# EasyEDA Pro project 主板.eprj, board PCB1
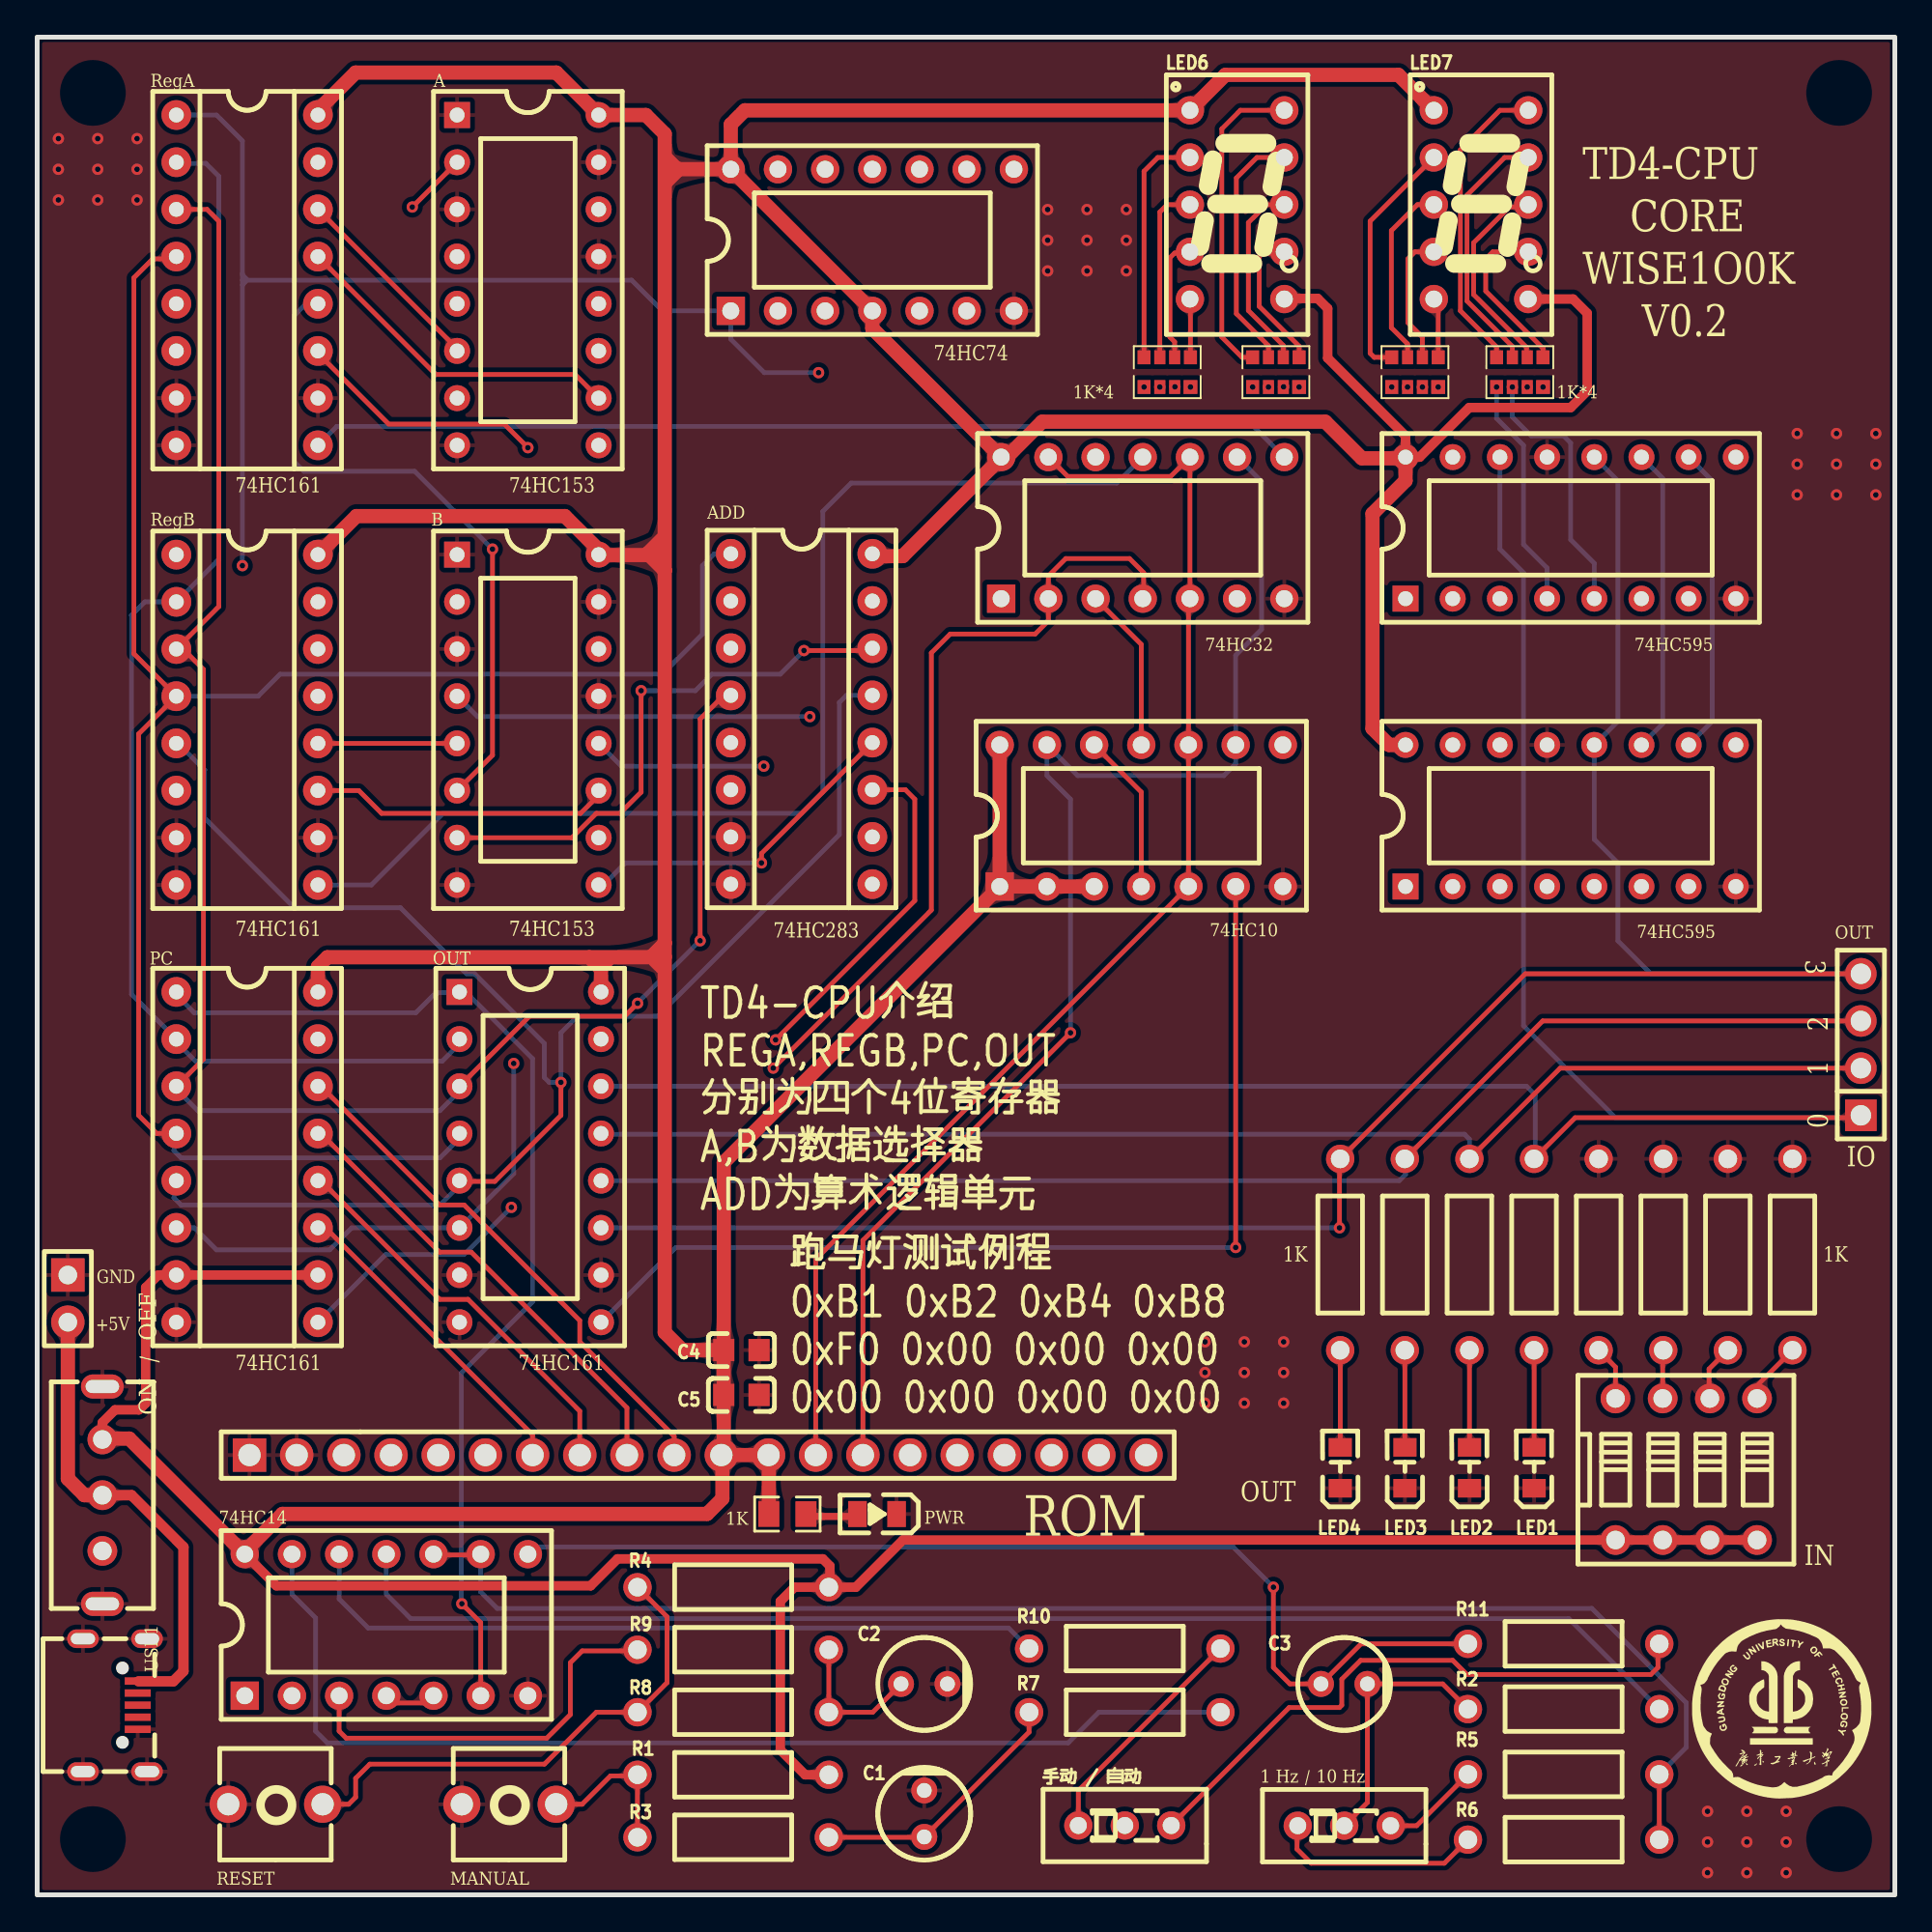
[diagram p2: board, top side]
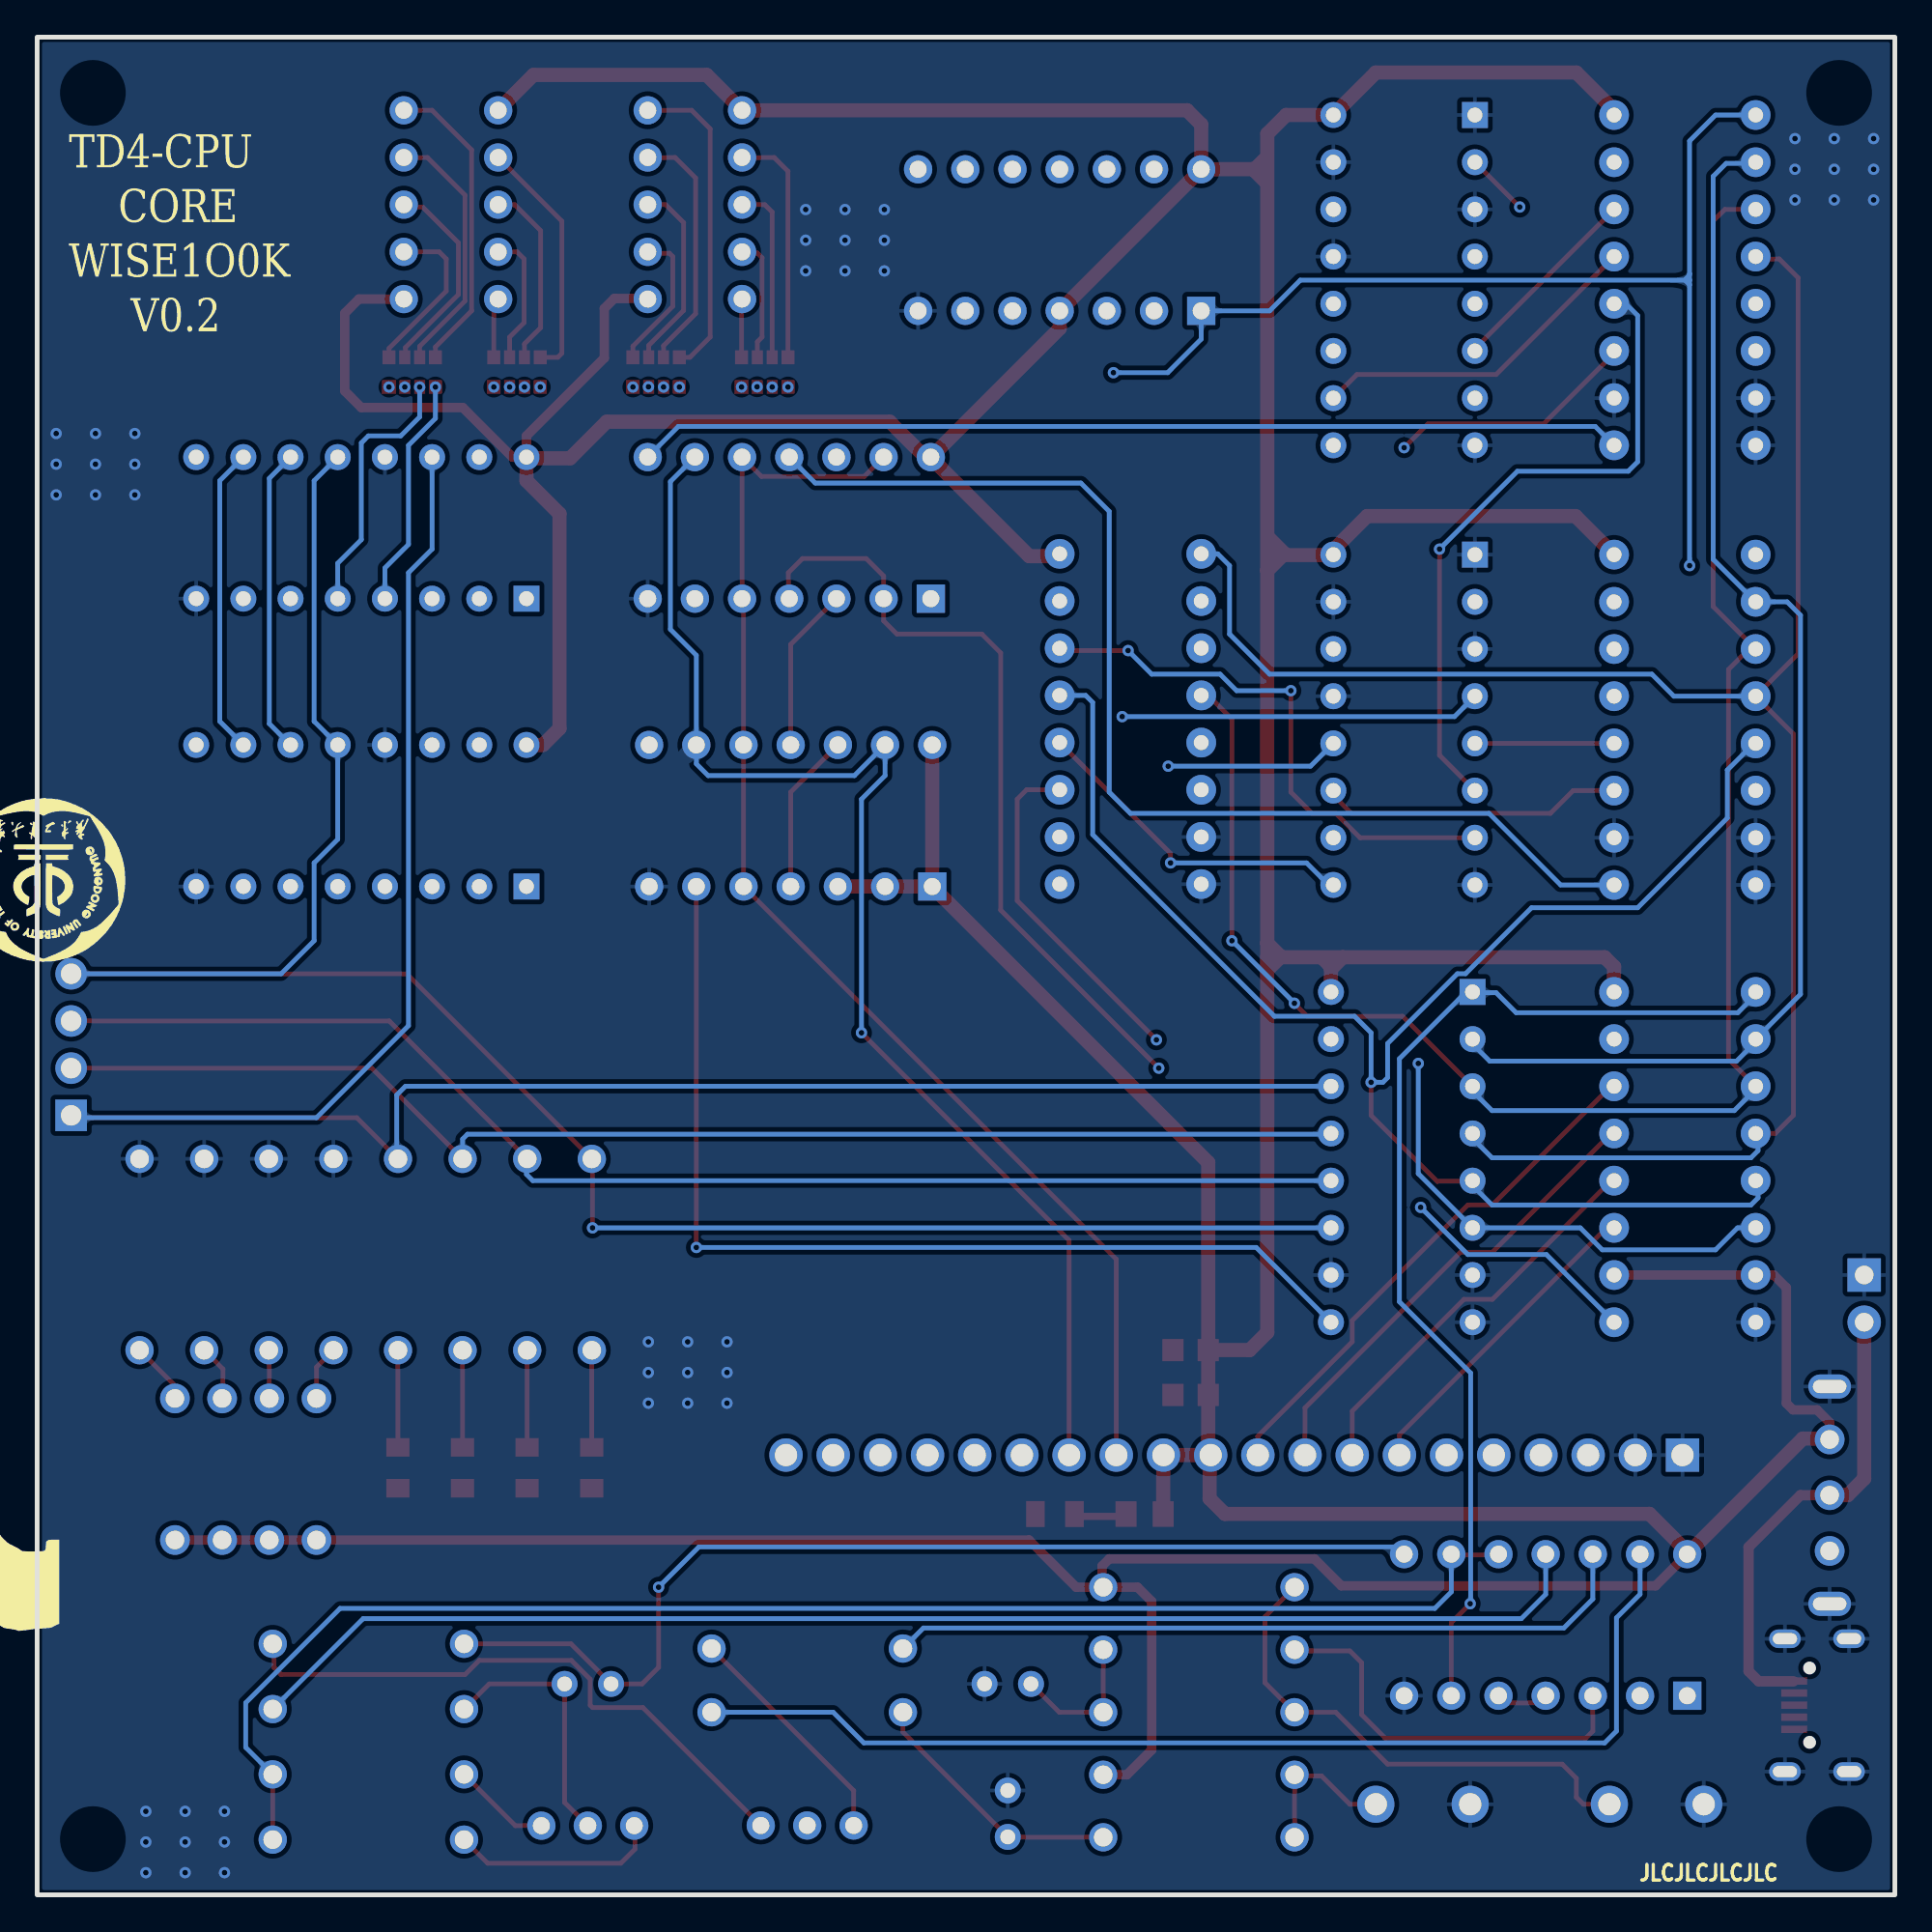
[diagram p3: board, bottom side, seen from below]

Outline 100 x 100 mm; copper layers: Top Layer, Inner1, Inner2, Bottom Layer. Coordinates in mm from the lower left corner of the outline.
Outline path: rectangle 0,100 100,0
Stack: Top Layer 0.035mm 外层铜厚1oz / Dielectric1 0.2104mm 7628 RC49% 8.6mil / Inner1 0.0152mm 内层铜厚 / Dielectric2 1.065mm 1.1mm H/HOZ Copper / Inner2 0.0152mm 内层铜厚 / Dielectric3 0.2104mm 7628 RC49% 8.6mil / Bottom Layer 0.035mm 外层铜厚1oz

## Design rules (mm)
net +5V: VCC
template: 自定义配置
spacing copperThickness1oz (default): track to track 0.102, other pairs 0.152 to 0.3
spacing copperThickness2oz: track to track 0.203, other pairs 0.152 to 0.3
track width copperThickness1oz (default): min 0.127, default 0.254, max 2.54
track width copperThickness2oz: min 0.203, default 0.254, max 2.54
track width VCC: min 0.127, default 0.762, max 2.54
differential pair differentialPair (default): width min 0.127, default 0.254, max 2.54; gap min 0.152, default 0.152
via viaSize (default): diameter min 0.5, default 0.61, max 10; hole min 0.3, default 0.305, max 6.299
net class VCC uses VCC
net +5V uses VCC

## Placement (name value [footprint] x y rotation side)
1 Hz / 10 Hz  SS12D00G3  [SW-TH_SS-12D01-GX]  70.36 3.72 0 top
1K  1K  [R0805]  40.39 20.5 180 top
1K*4  -  [RES-ARRAY-SMD_0603-8P-L3.2-W1.6-TL]  66.68 81.97 90 top
1K*4#2  -  [RES-ARRAY-SMD_0603-8P-L3.2-W1.6-TL]  79.81 81.97 90 top
74HC10  SN74HC10N  [DIP-14_L17.8-W10.1-P2.54-LS7.62-BL]  59.44 58.09 0 top
74HC14  SN74HC14N  [DIP-14_L17.8-W10.1-P2.54-LS7.62-BL]  18.8 14.53 0 top
74HC32  SN74HC32N  [DIP-14_L17.8-W10.1-P2.54-LS7.62-BL]  59.51 73.58 0 top
74HC595  -  [DIP-16_L20.3-W10.1-P2.54-LS7.62-BL]  82.55 58.09 0 top
74HC595#2  -  [DIP-16_L20.3-W10.1-P2.54-LS7.62-BL]  82.55 73.58 0 top
A  SN74HC153N  [DIP-16_L20.3-W10.1-P2.54-LS7.62-BL]  26.42 86.92 270 top
ADD  SN74HC283N  [DIP-16_L20.3-W10.2-P2.54-LS7.6-BL]  41.15 63.3 270 top
B  SN74HC153N  [DIP-16_L20.3-W10.1-P2.54-LS7.62-BL]  26.42 63.25 270 top
C1  电解电容  [CAP-TH_BD5.0-P2.50-D0.5-FD]  47.75 4.37 90 top
C2  电解电容  [CAP-TH_BD5.0-P2.50-D0.5-FD]  47.75 11.35 0 top
C3  电解电容  [CAP-TH_BD5.0-P2.50-D0.5-FD]  70.36 11.35 0 top
C4  电解电容  [C0805]  37.91 29.32 0 top
C5  电解电容  [C0805]  37.91 26.91 0 top
LED1  -  [LED_0805]  80.59 23.04 90 top
LED2  -  [LED_0805]  77.11 23.04 90 top
LED3  -  [LED_0805]  73.63 23.04 90 top
LED4  -  [LED_0805]  70.15 23.04 90 top
LED6  FJ3161AH  [LED-SEG-TH_10P-L14.0-W7.5-P2.54-S5.08-TL]  64.59 90.98 0 top
LED7  FJ3161AH  [LED-SEG-TH_10P-L14.0-W7.5-P2.54-S5.08-TL]  77.72 90.98 0 top
MANUAL  YTS1S0161BBT00  [KEY-TH_2P-L6.0-W6.0-P5.00]  25.4 4.88 0 top
ON  /  OFF  -  [SW-TH_SHOU-HAN_SS12F44G4]  3.51 21.51 90 top
OUT  SN74HC161N  [HDR-TH_4P-P2.54-V-M]  98.17 45.77 90 top
OUT#2  -  [DIP-16_L20.3-W10.1-P2.54-LS7.62-BL]  26.54 39.72 270 top
PC  SN74HC161N  [DIP-16_L20.3-W10.2-P2.54-LS7.6-BL]  11.3 39.72 270 top
PWR  PWR  [LED0805-R-RD_GREEN]  45.21 20.5 180 top
R1  1kΩ  [Res_1/4W]  37.47 6.46 0 top
R2  100Ω  [Res_1/4W]  82.17 10 0 top
R3  10kΩ  [Res_1/4W]  37.47 3.1 0 top
R4  1kΩ  [Res_1/4W]  37.47 16.56 0 top
R5  3.3kΩ  [Res_1/4W]  82.17 6.49 0 top
R6  33kΩ  [Res_1/4W]  82.17 2.97 0 top
R7  100kΩ  [Res_1/4W]  58.55 9.83 0 top
R8  100Ω  [Res_1/4W]  37.47 9.83 0 top
R9  1kΩ  [Res_1/4W]  37.47 13.2 180 top
R10  100Ω  [Res_1/4W]  58.55 13.26 0 top
R11  100Ω  [Res_1/4W]  82.17 13.51 0 top
R12  1kΩ  [Res_1/4W]  70.14 34.47 90 top
R13  1kΩ  [Res_1/4W]  73.62 34.47 90 top
R14  1kΩ  [Res_1/4W]  77.1 34.47 90 top
R15  1kΩ  [Res_1/4W]  80.58 34.47 90 top
R16  1kΩ  [Res_1/4W]  94.49 34.47 90 top
R17  1kΩ  [Res_1/4W]  91.01 34.47 90 top
R18  1kΩ  [Res_1/4W]  87.53 34.47 90 top
R19  1kΩ  [Res_1/4W]  84.05 34.47 90 top
R20  1K排阻0603*4  [RES-ARRAY-SMD_0603-8P-L3.2-W1.6-TL]  60.83 81.97 90 top
R22  1K排阻0603*4  [RES-ARRAY-SMD_0603-8P-L3.2-W1.6-TL]  74.17 81.97 90 top
RegA  SN74HC161N  [DIP-16_L20.3-W10.2-P2.54-LS7.6-BL]  11.3 86.92 270 top
RegB  SN74HC161N  [DIP-16_L20.3-W10.2-P2.54-LS7.6-BL]  11.3 63.25 270 top
RESET  YTS1S0161BBT00  [KEY-TH_2P-L6.0-W6.0-P5.00]  12.83 4.88 0 top
SW1  DS-04RP  [SW-TH_DS-04XP]  88.77 22.91 0 top
U2  SN74HC74N  [DIP-14_L17.8-W10.1-P2.54-LS7.62-BL]  44.96 89.08 0 top
U6  X6511FV-20-C85D32  [HDR-TH_20P-P2.54-V-F]  35.56 23.67 0 top
U7  Jumper2  [HDR-TH_2P-P2.54-V-M-1]  1.65 32.09 270 top
USB1  -  [USB_Micro]  4.19 10.21 270 top
手动 / 自动  SS12D00G3  [SW-TH_SS-12D01-GX]  58.55 3.73 0 top

## Footprints (pads in the part's own frame, mm; a bottom-side part is the same pattern mirrored in y, then rotated)
C0805
  rect 1.14x1.2 smd: 1(-0.95,0) 2(0.95,0)
CAP-TH_BD5.0-P2.50-D0.5-FD
  round 1.4 hole 0.8: 1(-1.25,0) 2(1.25,0)
DIP-14_L17.8-W10.1-P2.54-LS7.62-BL
  rect 1.524x1.524 hole 0.914: 1(-7.62,-3.81)
  round 1.524 hole 0.914: 2(-5.08,-3.81) 3(-2.54,-3.81) 4(0,-3.81) 5(2.54,-3.81) 6(5.08,-3.81) 7(7.62,-3.81) 8(7.62,3.81) 9(5.08,3.81) 10(2.54,3.81) 11(0,3.81) 12(-2.54,3.81) 13(-5.08,3.81) 14(-7.62,3.81)
DIP-16_L20.3-W10.1-P2.54-LS7.62-BL
  rect 1.4x1.4 hole 0.8: 1(-8.89,-3.81)
  round 1.4 hole 0.8: 2(-6.35,-3.81) 3(-3.81,-3.81) 4(-1.27,-3.81) 5(1.27,-3.81) 6(3.81,-3.81) 7(6.35,-3.81) 8(8.89,-3.81) 9(8.89,3.81) 10(6.35,3.81) 11(3.81,3.81) 12(1.27,3.81) 13(-1.27,3.81) 14(-3.81,3.81) 15(-6.35,3.81) 16(-8.89,3.81)
DIP-16_L20.3-W10.2-P2.54-LS7.6-BL
  round 1.6 hole 0.8: 1(-8.89,-3.81) 2(-6.35,-3.81) 3(-3.81,-3.81) 4(-1.27,-3.81) 5(1.27,-3.81) 6(3.81,-3.81) 7(6.35,-3.81) 8(8.89,-3.81) 9(8.89,3.81) 10(6.35,3.81) 11(3.81,3.81) 12(1.27,3.81) 13(-1.27,3.81) 14(-3.81,3.81) 15(-6.35,3.81) 16(-8.89,3.81)
HDR-TH_2P-P2.54-V-M-1
  rect 1.8x1.8 hole 1: 1(-1.27,0)
  round 1.8 hole 1: 2(1.27,0)
HDR-TH_4P-P2.54-V-M
  rect 1.7x1.7 hole 1.1: 1(-3.81,0)
  round 1.7 hole 1.1: 2(-1.27,0) 3(1.27,0) 4(3.81,0)
HDR-TH_20P-P2.54-V-F
  rect 1.8x1.8 hole 1.2: 1(-24.13,0)
  round 1.8 hole 1.2: 2(-21.59,0) 3(-19.05,0) 4(-16.51,0) 5(-13.97,0) 6(-11.43,0) 7(-8.89,0) 8(-6.35,0) 9(-3.81,0) 10(-1.27,0) 11(1.27,0) 12(3.81,0) 13(6.35,0) 14(8.89,0) 15(11.43,0) 16(13.97,0) 17(16.51,0) 18(19.05,0) 19(21.59,0) 20(24.13,0)
KEY-TH_2P-L6.0-W6.0-P5.00
  round 2 hole 1.2: 1(-2.54,0) 2(2.54,0)
LED0805-R-RD_GREEN
  rect 1x1.399 smd: 1(1.05,0) 2(-1.05,0)
LED-SEG-TH_10P-L14.0-W7.5-P2.54-S5.08-TL
  round 1.524 hole 0.914: 1(-2.54,5.08) 2(-2.54,2.54) 3(-2.54,0) 4(-2.54,-2.54) 5(-2.54,-5.08) 6(2.54,-5.08) 7(2.54,-2.54) 8(2.54,0) 9(2.54,2.54) 10(2.54,5.08)
LED_0805
  rect 1x1.25 smd: 1(-1.15,0.005) 2(1.05,0.005)
R0805
  rect 1.133x1.377 smd: 1(-1,0) 2(1,0)
RES-ARRAY-SMD_0603-8P-L3.2-W1.6-TL
  rect 0.75x0.7 smd: 1(-0.8,1.25) 5(0.8,-1.25) 8(0.8,1.25)
  rect 0.75x0.6 smd: 2(-0.8,0.4) 3(-0.8,-0.4) 6(0.8,-0.4) 7(0.8,0.4)
  rect 0.75x0.75 smd: 4(-0.8,-1.25)
Res_1/4W
  round 1.524 hole 1: 1(-5.15,0) 2(5.15,0)
SW-TH_DS-04XP
  round 1.6 hole 1: 1(-3.81,-3.81) 2(-1.27,-3.81) 3(1.27,-3.81) 4(3.81,-3.81) 5(3.81,3.81) 6(1.27,3.81) 7(-1.27,3.81) 8(-3.81,3.81)
SW-TH_SHOU-HAN_SS12F44G4
  round 1.6 hole 1: 1(-3,0) 2(0,0) 3(3,0)
  oval 1.3x2.3 hole 0.7x1.8: 4(5.85,0) 5(-5.85,0)
SW-TH_SS-12D01-GX
  round 1.524 hole 0.914: 1(-2.5,0) 2(0,0) 3(2.5,0)
USB_Micro
  rect 0.4x1.4 smd: 1(-1.3,1.225) 2(-0.65,1.225) 3(0,1.225) 4(0.65,1.225) 5(1.3,1.225)
  oval 1x1.7 hole 0.6x1.3: 6(-3.575,1.725) 6(-3.575,-1.725) 6(3.575,1.725) 6(3.575,-1.725)

## Nets
+5V: 1K.2 74HC10.1 74HC10.2 74HC10.3 74HC10.14 74HC14.14 74HC32.14 74HC595.16 74HC595#2.16 A.16 ADD.16 B.16 C4.1 C5.1 LED6.1 LED6.6 LED7.1 LED7.6 ON  /  OFF.3 OUT#2.16 PC.7 PC.10 PC.16 R1.2 R4.2 RegA.16 RegB.16 SW1.1 SW1.2 SW1.3 SW1.4 U2.4 U2.14 U6.11 U6.12
GND: 74HC10.7 74HC14.7 74HC32.7 74HC595.8 74HC595.13 74HC595#2.8 74HC595#2.13 A.1 A.3 A.8 A.13 A.15 ADD.7 ADD.8 B.1 B.3 B.8 B.13 B.15 C1.2 C2.2 C4.2 C5.2 LED1.1 LED2.1 LED3.1 LED4.1 MANUAL.1 ON  /  OFF.4 ON  /  OFF.5 OUT#2.7 OUT#2.8 OUT#2.10 PC.8 PWR.2 R16.2 R17.2 R18.2 R19.2 RegA.7 RegA.8 RegA.10 RegB.7 RegB.8 RegB.10 RESET.1 U2.7 U6.1 U6.2 U7.1 USB1.5 USB1.6
5A: 74HC14.11 R2.2
5Y: 74HC14.9 74HC14.10 R5.2 R6.2
A0: PC.14 U6.10
A1: PC.13 U6.9
A2: PC.12 U6.8
A3: PC.11 U6.7
AIN0: A.6 RegA.14
AIN1: A.10 RegA.13
AIN2: B.6 RegA.12
AIN3: B.10 RegA.11
BIN0: A.5 RegB.14
BIN1: A.11 RegB.13
BIN2: B.5 RegB.12
BIN3: B.11 RegB.11
D0: ADD.6 U6.20
D1: ADD.2 U6.19
D2: ADD.15 U6.18
D3: ADD.11 U6.17
D4: 74HC32.2 74HC32.4 U6.16
D5: A.2 B.2 U6.15
D6: 74HC10.9 74HC10.13 74HC32.9 U6.14
D7: 74HC10.5 74HC10.10 74HC32.5 74HC32.10 74HC32.13 U6.13
IN0: A.4 R16.1 SW1.5
IN1: A.12 R17.1 SW1.6
IN2: B.4 R18.1 SW1.7
IN3: B.12 R19.1 SW1.8
LEDA1: 1K*4.1 74HC595#2.15
LEDA2: 1K*4#2.1 74HC595#2.4
LEDB1: 1K*4.2 74HC595#2.1
LEDB2: 1K*4#2.2 74HC595#2.5
LEDC1: 1K*4.3 74HC595#2.2
LEDC2: 1K*4#2.3 74HC595#2.6
LEDD1: 74HC595#2.3 R20.4
LEDD2: 74HC595#2.7 R22.4
LEDE1: 74HC595.15 R20.3
LEDE2: 74HC595.4 R22.3
LEDF1: 74HC595.1 R20.1
LEDF2: 74HC595.5 R22.1
LEDG1: 74HC595.2 R20.2
LEDG2: 74HC595.6 R22.2
LEDH1: 1K*4.4 74HC595.3
LEDH2: 1K*4#2.4 74HC595.7
OUT0: 74HC595#2.14 OUT.1 OUT#2.14 R15.2
OUT1: 74HC595.14 OUT.2 OUT#2.13 R14.2
OUT2: 74HC595.11 74HC595#2.11 OUT.3 OUT#2.12 R13.2
OUT3: 74HC595.12 74HC595#2.12 OUT.4 OUT#2.11 R12.2
Y1: A.7 ADD.5
Y2: A.9 ADD.3
Y3: ADD.14 B.7
Y4: ADD.12 B.9
Y12: U6.3
Y13: U6.4
Y14: U6.5
Y15: U6.6
$1N4248: LED4.2 R12.1
$1N4255: LED1.2 R15.1
$1N4259: LED2.2 R14.1
$1N4264: LED3.2 R13.1
$1N6580: ADD.4 OUT#2.3 PC.3 RegA.3 RegB.3
$1N6590: ADD.1 OUT#2.4 PC.4 RegA.4 RegB.4
$1N6595: ADD.13 OUT#2.5 PC.5 RegA.5 RegB.5
$1N6604: ADD.10 OUT#2.6 PC.6 RegA.6 RegB.6
$1N9749: C1.1 R3.2 R7.1
$1N9779: MANUAL.2 R1.1 R3.1
$1N9798: R10.2 手动 / 自动.1
$1N9808: 1 Hz / 10 Hz.2 C3.2 R2.1
$1N9868: R4.1 R8.1 RESET.2
$1N9876: C2.1 R8.2 R9.1
$1N9954: 74HC14.3 R9.2
$1N9958: 74HC14.4 74HC14.5
$1N9962: 74HC14.6 74HC595.10 74HC595#2.10 OUT#2.1 PC.1 RegA.1 RegB.1 U2.1
$1N11263: ADD.9 U2.2
$1N11340: 74HC32.1 U2.6
$1N11344: OUT#2.2 PC.2 RegA.2 RegB.2 U2.3 手动 / 自动.2
$1N12748: R11.2 手动 / 自动.3
$1N12905: 74HC14.13 R7.2
$1N12949: 1 Hz / 10 Hz.3 R5.1
$1N12955: 1 Hz / 10 Hz.1 R6.1
$1N13114: 74HC14.12 R10.1
$1N13155: 74HC14.8 C3.1 R11.1
$1N14608: 74HC10.6 OUT#2.9
$1N14668: 74HC32.6 A.14 B.14
$1N14754: 74HC10.11 74HC32.3
$1N14761: 74HC10.4 74HC10.12 74HC32.12
$1N14785: 74HC10.8 PC.9
$1N14858: 74HC32.8 RegA.9
$1N14897: 74HC32.11 RegB.9
$1N16389: ON  /  OFF.2 U7.2 USB1.1
$1N30627: 1K.1 PWR.1
$1N33937: LED6.2 R20.8
$1N33943: LED6.3 R20.7
$1N33953: LED6.4 R20.6
$1N33959: LED6.5 R20.5
$1N34000: 1K*4.8 LED6.10
$1N34011: 1K*4.7 LED6.9
$1N34029: 1K*4.6 LED6.8
$1N34063: 1K*4.5 LED6.7
$1N35657: LED7.2 R22.8
$1N35663: LED7.3 R22.7
$1N35669: LED7.4 R22.6
$1N35676: LED7.5 R22.5
$1N35683: 1K*4#2.8 LED7.10
$1N35689: 1K*4#2.7 LED7.9
$1N35696: 1K*4#2.6 LED7.8
$1N35703: 1K*4#2.5 LED7.7

Pads without a net: 74HC14 1 2; 74HC595 9; 74HC595#2 9; ON  /  OFF 1; OUT#2 15; PC 15; RegA 15; RegB 15; U2 5 8 9 10 11 12 13; USB1 2 3 4

## Via types
v1: diameter 0.61, hole 0.305, Top Layer to Bottom Layer, 83 vias

## Routing (per net, layer and track width the routed paths; a pad name or vN(x,y) marks a point on that pad's centre or on a via; arc(x,y) is an arc through that point)
+5V: length 500.9
  Top Layer w0.508: LED7.6 82.68,85.9 83.44,85.14 83.44,80.95 82.55,80.06 77.09,80.06 74.42,77.39 74HC595#2.16 73.66,78.54 69.47,82.73 69.47,85.39 68.93,85.93 67.16,85.93 LED6.6 ; R4.2 44.07,16.56 46.61,19.1 SW1.1 SW1.2 SW1.3 SW1.4 ; R4.2 42.67,16.62 42.67,17.7 42.29,18.09 31.24,18.09 29.79,16.64 12.88,16.64 74HC14.14 ; R4.2 40.77,16.56 40,15.8 40,7.8 41.34,6.46 R1.2 ; 15.11,33.36 6.52,33.36 5.84,32.69 5.84,26.47 5.48,26.11 4.19,26.11 3.51,25.43 ON  /  OFF.3
  Top Layer w0.762: 34.51,92.89 33.89,92.89 33.87,92.91 ; 34.51,92.89 34.51,92.93 ; 34.51,92.89 34.51,92.85 33.8,92.14 ; 34.51,92.89 37.33,92.89 U2.14 ; 33.78,71.3 33.76,71.3 32.94,72.12 ; 33.78,71.3 33.8,71.3 ; 33.78,71.3 33.78,51.23 ; 33.78,71.3 33.78,94.79 32.77,95.81 A.16 27.94,98.09 17.14,98.09 15.11,96.06 RegA.16 ; U2.14 37.34,95.3 38.1,96.06 LED6.1 63.96,97.97 73.28,97.97 LED7.1 ; U2.14 44.82,85.41 44.96,85.41 44.96,84.32 51.9,77.38 ; OUT#2.16 30.35,49.83 29.72,50.47 ; 74HC32.14 52.2,77.39 54.1,79.3 69.34,79.3 71.31,77.33 73.6,77.33 74HC595#2.16 73.66,76.12 71.88,74.35 71.88,62.79 72.77,61.9 74HC595.16 ; 33.78,50.5 33.75,50.47 33.09,50.47 ; 33.78,50.5 33.78,51.23 ; 33.78,50.5 33.78,30.28 34.73,29.32 C4.1 ; C4.1 C5.1 36.96,23.8 U6.11 ; C4.1 36.96,39.42 74HC10.1 ; ON  /  OFF.3 3.56,24.56 4.95,24.56 74HC14.14 11.18,18.47 13.21,20.51 36.06,20.51 36.89,21.33 36.89,23.62 U6.11 ; 32.94,72.12 33.66,72.12 33.75,72.21 ; 32.94,72.12 32.88,72.18 32.88,72.22 33.7,73.04 ; 32.94,72.12 30.46,72.12 ; 33.78,51.23 33.11,50.56 33.11,50.55 ; 33.78,51.23 33.79,51.24 ; 74HC10.1 74HC10.2 74HC10.3 ; 74HC10.1 74HC10.14 ; 29.72,50.47 33.09,50.47 ; 29.72,50.47 15.62,50.47 15.11,49.96 PC.16 ; 33.09,50.47 33.07,50.48 ; 33.09,50.47 33.75,49.81 ; 30.8,50.42 30.4,50.01 30.4,49.97 ; U6.11 U6.12 39.39,23.66 1K.2 ; RegB.16 17.19,74.22 28.4,74.22 30.48,72.14 ; 51.82,77.29 46.59,72.06 44.97,72.06 ; 34.4,92.94 33.85,93.5
GND:
  vias: v1(1.14,94.54) v1(1.14,92.89) v1(1.14,91.24) v1(3.26,94.54) v1(3.26,92.89) v1(3.26,91.24) v1(5.38,94.54) v1(5.38,92.89) v1(5.38,91.24) v1(54.4,90.72) v1(54.4,89.07) v1(54.4,87.42) v1(56.51,90.72) v1(56.51,89.07) v1(56.51,87.42) v1(58.63,90.72) v1(58.63,89.07) v1(58.63,87.42) v1(62.87,29.77) v1(62.87,28.12) v1(62.87,26.47) v1(64.98,29.77) v1(64.98,28.12) v1(64.98,26.47) v1(67.1,29.77) v1(67.1,28.12) v1(67.1,26.47) v1(89.92,4.5) v1(89.92,2.84) v1(89.92,1.19) v1(92.03,4.5) v1(92.03,2.84) v1(92.03,1.19) v1(94.15,4.5) v1(94.15,2.84) v1(94.15,1.19) v1(94.74,78.66) v1(94.74,77.01) v1(94.74,75.36) v1(96.86,78.66) v1(96.86,77.01) v1(96.86,75.36) v1(98.98,78.66) v1(98.98,77.01) v1(98.98,75.36)
5A: length 73.6
  Bottom Layer w0.254: 18.8,18.73 18.8,16.18 20.11,14.87 82.45,14.87 R2.2
5Y: length 80.7
  Top Layer w0.254: 21.34,18.73 21.77,18.3 23.44,18.3 23.88,18.73 ; R6.2 R5.2
  Bottom Layer w0.254: 23.88,18.73 23.88,16.31 24.77,15.42 83.69,15.42 88.77,10.34 88.77,7.94 R5.2
A0: length 28.5
  Top Layer w0.254: U6.10 34.29,24.69 29.21,29.77 29.21,30.91 22.99,37.14 21.66,37.14 15.27,43.53
A1: length 25.1
  Top Layer w0.254: 15.27,40.98 21.66,34.59 23.37,34.59 31.75,26.21 U6.9
A2: length 21.4
  Top Layer w0.254: U6.8 29.21,26.04 23.19,32.06 21.66,32.06 15.27,38.44
A3: length 16.8
  Top Layer w0.254: 15.53,35.91 26.67,24.76 U6.7
AIN0: length 10.7
  Top Layer w0.254: RegA.14 22.61,83.24 A.6
AIN1: length 18.3
  Top Layer w0.254: RegA.13 21.46,81.84 28.96,81.84 A.10
AIN2: length 35.8
  Top Layer w0.254: B.6 24.51,61.35 v1(24.51,72.44)
  Bottom Layer w0.254: v1(24.51,72.44) 20.32,76.63 14.35,76.63 13.84,77.14 13.84,85.01 14.48,85.65 RegA.12
AIN3: length 36.1
  Top Layer w0.254: v1(26.42,77.9) 25.15,79.17 18.92,79.17 15.11,82.98 RegA.11
  Inner1 w0.254: v1(26.42,77.9) 26.42,60.71 B.10
BIN0: length 22.4
  Inner1 w0.254: RegB.14 20.29,72.24 20.29,84.47 21.46,85.65 A.5
BIN1: length 24.8
  Inner1 w0.254: A.11 21.34,74.22 21.34,70.75 RegB.13
BIN2: length 7.5
  Top Layer w0.254: RegB.12 B.5
BIN3: length 16.3
  Top Layer w0.254: B.11 30.23,59.19 29.25,58.22 18.54,58.22 17.32,59.44 RegB.11
D0: length 46.2
  Inner1 w0.254: ADD.6 39.24,59.49 40,58.72 40,54.41 59.69,34.72 U6.20
D1: length 56.3
  Inner1 w0.254: U6.19 57.15,32.56 34.8,54.92 34.8,67.11 37.34,69.65
D2: length 66.4
  Inner1 w0.254: 44.96,69.65 43.81,70.79 35.81,70.79 33.53,68.5 33.53,54.53 54.61,33.45 U6.18
D3: length 46
  Top Layer w0.254: ADD.11 46.74,59.49 47.24,58.98 47.24,53.52 v1(39.75,46.03)
  Inner1 w0.254: U6.17 52.07,33.71 v1(39.75,46.03)
D4: length 67.5
  Top Layer w0.254: 74HC32.4 59.56,69.82 59.56,71.17 58.8,71.93 55.37,71.93 54.43,71 74HC32.2 54.43,68.58 53.72,67.87 49.15,67.87 48.13,66.85 48.13,53.01 v1(39.62,44.5)
  Inner1 w0.254: v1(39.62,44.5) 49.53,34.59 U6.16
D5: length 81.8
  Top Layer w0.254: A.2 v1(20.19,90.86)
  Inner1 w0.254: U6.15 46.99,35.1 24.26,57.84 24.26,68.21 22.86,69.6 B.2
  Inner2 w0.254: B.2 20.19,72.02 v1(20.19,90.86)
D6: length 72.1
  Top Layer w0.254: v1(55.63,46.41) 44.45,35.23 U6.14
  Bottom Layer w0.254: v1(55.63,46.41) 55.63,58.98 54.36,60.25 74HC10.13 56.01,60.25 63.88,60.25 64.52,60.88 74HC10.9 64.52,66.73 65.91,68.12 65.91,76.08 74HC32.9
D7: length 70.5
  Top Layer w0.254: 74HC32.13 55.48,76.35 61.01,76.35 74HC32.10 74HC32.5 61.98,69.7 74HC10.10 74HC10.5 41.91,34.21 U6.13
IN0: length 120.4
  Top Layer w0.254: 92.58,27.41 R16.1
  Inner1 w0.254: A.4 23.76,88.19 25.03,86.92 31.24,86.92 33.93,84.23 42.06,84.23 47.24,79.05 47.24,54.15 50.04,51.36 84.07,51.36 92.71,42.72 92.71,31.1 R16.1
IN1: length 106.8
  Top Layer w0.254: SW1.6 90,26.76 90,28.31 R17.1
  Inner1 w0.254: R17.1 89.15,31.17 89.15,44.88 83.69,50.34 49.4,50.34 46.61,53.14 46.61,72.82 36.07,83.36 32.38,83.36 30.23,85.52 A.12
IN2: length 95.7
  Top Layer w0.254: R18.1 87.5,29.29 SW1.7 87.5,26.47
  Inner1 w0.254: R18.1 85.98,30.87 85.98,46.41 83.19,49.2 48.51,49.2 41.59,56.12 v1(41.59,63.42)
  Bottom Layer w0.254: v1(41.59,63.42) 23.71,63.42 B.4
IN3: length 82.7
  Top Layer w0.254: 84.96,26.47 SW1.8 84.96,28.41 R19.1
  Inner1 w0.254: R19.1 82.3,31.08 82.3,47.68 81.79,48.18 47.62,48.18 40.89,54.92 40.89,58.98 v1(39.12,60.76)
  Bottom Layer w0.254: v1(39.12,60.76) 31.45,60.76 B.12
LEDA1: length 14.7
  Inner1 w0.254: 74HC595#2.15 76.2,76.38 75.82,76 72.26,76 68.25,80.01 65.61,80.01 65.43,80.19 v1(65.43,81.17)
LEDA2: length 12.5
  Bottom Layer w0.254: 74HC595#2.4 81.28,71.42 80.01,72.69 80.01,78.03 78.56,79.48 v1(78.56,81.17)
LEDB1: length 14.4
  Inner2 w0.254: v1(66.28,81.17) 66.28,79.72 73.66,72.34 74HC595#2.1
LEDB2: length 14.2
  Bottom Layer w0.254: v1(79.41,81.17) 79.41,79.55 80.43,78.54 82.17,78.54 82.55,78.16 82.55,72.95 83.82,71.68 74HC595#2.5
LEDC1: length 15.2
  Inner2 w0.254: v1(67.09,81.18) 67.09,79.81 76.2,70.7 74HC595#2.2
LEDC2: length 15.8
  Inner2 w0.254: v1(80.21,81.17) 80.21,79.68 81.35,78.54 84.58,78.54 85.09,78.03 85.09,73.2 86.36,71.93 74HC595#2.6
LEDD1: length 21.9
  Inner1 w0.254: 74HC595#2.3 77.59,69.77 67.88,79.48 62.81,79.48 62.08,80.21 v1(62.08,81.17)
LEDD2: length 20.2
  Inner1 w0.254: 74HC595#2.7 82.42,76.25 82.42,78.66 81.46,79.63 75.92,79.63 75.42,80.13 v1(75.42,81.17)
LEDE1: length 27.4
  Inner1 w0.254: v1(61.25,81.18) 61.25,79.98 62.1,79.12 65.38,79.12 65.64,78.87 65.64,77.29 71.69,71.23 71.69,66.41 74HC595.15
LEDE2: length 32.1
  Inner1 w0.254: 74HC595.4 81.28,55.93 79.88,57.33 79.88,78.54 79.3,79.12 75.13,79.12 74.57,79.68 v1(74.57,81.17)
LEDF1: length 32.7
  Inner1 w0.254: v1(59.58,81.17) 59.58,79.88 60.56,78.91 60.56,76.15 65.79,70.92 65.79,65.33 73.66,57.45 74HC595.1
LEDF2: length 33
  Inner2 w0.254: 74HC595.5 83.82,55.68 79.88,59.61 79.88,71.93 78.74,73.08 75.95,73.08 74.93,74.09 74.93,77.51 72.92,79.52 v1(72.92,81.17)
LEDG1: length 34.1
  Inner1 w0.254: v1(60.43,81.17) 60.43,79.91 61.67,78.66 62.84,78.66 63.1,78.41 63.1,76.4 68.45,71.04 68.45,65.46 76.2,57.71 74HC595.2
LEDG2: length 35.7
  Inner2 w0.254: v1(73.77,81.17) 73.79,81.15 73.79,79.68 74.8,78.66 77.09,78.66 77.47,78.28 77.47,74.22 77.98,73.71 81.79,73.71 82.42,73.08 82.42,60 86.36,56.06 74HC595.6
LEDH1: length 31.4
  Inner2 w0.254: v1(67.93,81.17) 67.94,81.15 67.94,79.93 77.6,70.28 77.6,56.31 78.74,55.17 74HC595.3
LEDH2: length 32.8
  Inner2 w0.254: v1(81.06,81.17) 81.06,79.77 81.79,79.05 86.36,79.05 87.63,77.78 87.63,57.45 88.9,56.19 74HC595.7
OUT0: length 123.6
  Top Layer w0.254: OUT.1 98.04,41.83 82.79,41.83 R15.2
  Bottom Layer w0.254: 74HC595#2.14 78.74,72.44 80.01,71.17 80.01,46.79 84.96,41.83 98.04,41.83 OUT.1 ; 30.64,43.53 80.18,43.53 80.65,43.06 80.65,39.69 R15.2
OUT1: length 101.7
  Top Layer w0.254: OUT.2 81.98,44.5 R14.2
  Inner1 w0.254: OUT.2 92.07,44.5 84.33,52.25 81.15,52.25 80.01,53.39 80.01,55.3 78.74,56.57 74HC595.14
  Bottom Layer w0.254: R14.2 77.1,40.68 76.84,40.94 30.55,40.94 30.51,40.98
OUT2: length 112.2
  Top Layer w0.254: OUT.3 81.04,47.04 R13.2
  Inner1 w0.254: 74HC595.11 86.36,57.33 87.63,56.06 87.63,50.34 90.93,47.04 OUT.3
  Bottom Layer w0.254: 74HC595.11 87.5,63.04 87.5,76.25 74HC595#2.11 ; R13.2 73.62,39.08 73.66,39.04 73.66,38.79 73.32,38.44 30.51,38.44
OUT3: length 116.9
  Top Layer w0.254: OUT.4 80.11,49.58 R12.2 70.1,39.58 v1(70.1,35.91)
  Bottom Layer w0.254: 30.51,35.91 v1(70.1,35.91) ; OUT.4 86.87,49.58 85.09,51.36 85.09,55.55 83.82,56.82 74HC595.12 85.09,63.17 85.09,76.12 74HC595#2.12
Y1: length 29
  Inner2 w0.254: ADD.5 33.4,65.96 26.03,65.96 25.34,66.66 25.34,77.84 A.7
Y2: length 13.9
  Inner2 w0.254: A.9 30.23,74.22 ADD.3
Y3: length 29.8
  Top Layer w0.254: v1(32.51,64.82) 32.51,59.36 31.37,58.22 30.1,58.22 28.79,56.9 B.7 ; v1(41.28,66.98) 44.83,66.98 ADD.14
  Bottom Layer w0.254: v1(32.51,64.82) 35.43,64.82 36.32,65.71 40,65.71 v1(41.28,66.98)
Y4: length 18.2
  Top Layer w0.254: v1(38.99,55.55) 38.99,56.06 ADD.12
  Bottom Layer w0.254: v1(38.99,55.55) 31.67,55.55 30.48,54.36 B.9
$1N4248: length 5.4
  Top Layer w0.254: 70.15,29.31 70.15,29.44 ; 70.15,29.31 LED4.2 ; 70.15,29.31 R12.1
$1N4255: length 5.4
  Top Layer w0.254: 80.58,29.31 R15.1 ; 80.58,29.31 80.58,29.44 ; 80.58,29.31 LED1.2
$1N4259: length 5.4
  Top Layer w0.254: LED2.2 77.1,29.31 ; 77.1,29.31 R14.1 ; 77.1,29.31 77.1,29.44
$1N4264: length 5.4
  Top Layer w0.254: 73.63,29.31 R13.1 ; 73.63,29.31 LED3.2 ; 73.63,29.31 73.63,29.44
$1N6580: length 97.9
  Top Layer w0.254: v1(35.69,51.36) 35.69,63.3 36.96,64.57 ADD.4 ; OUT#2.3 26.5,47.3 31.62,47.3 v1(32.32,47.99) ; PC.3 8.95,44.98 8.95,65.96 7.85,67.06 RegB.3 9.78,69.35 9.78,90.09 9.14,90.73 RegA.3
  Bottom Layer w0.254: 22.57,43.1 21.68,42.22 8.64,42.22 7.33,43.53 ; 35.68,51.36 32.32,48.01 v1(32.32,47.99)
$1N6590: length 103.9
  Top Layer w0.254: PC.4 6.44,40.98 5.46,41.96 5.46,62.49 RegB.4 5.21,66.81 5.21,87.05 6.22,88.06 7.37,88.06 RegA.4
  Bottom Layer w0.254: RegB.4 11.89,64.52 13.08,65.71 33.66,65.71 35.81,67.87 35.81,71.55 36.45,72.19 ADD.1 ; 22.57,40.56 21.68,39.67 7.75,39.67 7.37,40.06 7.37,40.95 7.33,40.98
$1N6595: length 114
  Top Layer w0.254: 22.73,38.44 22.77,38.41 24.64,38.41 28.19,41.96 v1(28.19,43.74)
  Inner2 w0.254: RegB.5 9.78,64.27 9.78,85.14 9.27,85.65 RegA.5
  Bottom Layer w0.254: RegB.5 7.54,62.03 9.01,60.55 9.02,60.55 9.02,57.96 13.84,53.14 19.56,53.14 23.11,49.58 23.55,49.58 27.31,45.83 27.31,43.99 27.56,43.74 v1(28.19,43.74) 28.19,46.41 29.08,47.3 33.4,47.3 43.18,57.07 43.18,64.19 43.56,64.57 ADD.13 ; 22.57,38.02 21.68,37.14 7.75,37.14 7.37,37.52 7.37,38.41 7.33,38.44
$1N6604: length 101.8
  Inner2 w0.254: ADD.10 32.77,44.75 v1(25.65,44.75) 23.11,47.3 19.69,47.3 7.54,59.44 RegB.6 5.63,59.44 5.08,60 5.08,80.7 RegA.6
  Bottom Layer w0.254: OUT#2.6 25.65,38.83 v1(25.65,44.75) ; 22.57,35.48 22.15,35.91 16.93,35.91 15.75,34.72 9.65,34.72 8.47,35.91 7.33,35.91
$1N9749: length 14.2
  Top Layer w0.254: R3.2 47.73,3.1 C1.1 53.4,8.76 R7.1
$1N9779: length 8.4
  Top Layer w0.254: MANUAL.2 29.34,4.88 30.86,6.4 32.25,6.4 R1.1 R3.1
$1N9798: length 12.7
  Top Layer w0.254: R10.2 56.05,5.61 手动 / 自动.1
$1N9808: length 14.1
  Top Layer w0.254: 1 Hz / 10 Hz.2 71.61,4.97 C3.2 75.66,11.35 R2.1
$1N9868: length 27.6
  Top Layer w0.254: RESET.2 16.76,4.88 17.14,5.26 17.14,6.27 17.91,7.04 27.31,7.04 30.1,9.83 R8.1 33.91,11.42 33.91,14.97 R4.1
$1N9876: length 7.9
  Top Layer w0.254: C2.1 44.98,9.83 R8.2 R9.1
$1N9954: length 21.3
  Top Layer w0.254: 16.26,10.33 16.26,8.81 16.64,8.43 27.43,8.43 28.7,9.7 28.7,12.5 29.34,13.13 32.25,13.13 R9.2
$1N9958: length 2.5
  Top Layer w0.254: 18.8,10.33 21.34,10.33
$1N9962: length 219.3
  Top Layer w0.254: 23.88,10.33 23.88,14.66 v1(22.86,15.67)
  Inner1 w0.254: RegB.1 10.46,72.14 v1(11.05,71.55)
  Inner2 w0.254: v1(11.05,71.55) 12.65,69.95 12.65,57.84 14.81,55.68 15.66,55.68 OUT#2.1 ; v1(42.06,81.94) 87.4,81.94 88.9,80.44 74HC595#2.10
  Bottom Layer w0.254: v1(11.05,71.55) 11.05,86.92 ; 11.05,86.92 32,86.92 33.66,85.27 U2.1 37.34,83.74 39.14,81.94 v1(42.06,81.94) ; 11.05,86.92 11.05,87.26 ; 11.05,87.26 11.05,94.41 9.65,95.81 RegA.1 ; 11.05,87.26 11.06,87.19 11.28,86.97 ; 11.05,86.67 11.06,86.67 11.29,86.91 ; 74HC595.10 90.17,63.17 90.17,76.12 74HC595#2.10 ; v1(22.86,15.67) 22.83,15.7 22.83,28.09 26.67,31.93 26.67,45.01 23.07,48.61 OUT#2.1 22.69,48.56 21.46,48.56 20.38,47.49 8.45,47.49 7.33,48.61
$1N11263: length 37.1
  Inner2 w0.254: ADD.9 46.48,55.93 46.48,57.84 46.1,58.22 41.15,58.22 39.88,59.49 U2.2
$1N11340: length 17.4
  Inner1 w0.254: 74HC32.1 53.21,71.09 53.21,82.09 U2.6
$1N11344: length 179.6
  Inner2 w0.254: U2.3 42.42,86.54 41.78,87.17 37.08,87.17 32.26,92 13.08,92 11.81,93.27 RegA.2 ; OUT#2.2 24.26,44.54 24.26,35.86 25.57,34.55 50.21,34.55 55.88,28.88 55.88,6.4 手动 / 自动.2
  Bottom Layer w0.254: 7.33,46.06 8.52,44.88 21.81,44.88 22.57,45.64 ; RegA.2 7.56,93.21 9.08,93.21 9.78,92.51 9.78,71.89 RegB.2 5.8,69.6 5.08,68.89 5.08,48.48 PC.2
$1N12748: length 32.5
  Top Layer w0.254: R11.2 87.25,13.44 87.25,12.24 86.87,11.86 76.96,11.86 76.2,12.62 71.25,12.62 70.23,11.61 70.23,10.21 70.1,10.08 67.4,10.08 手动 / 自动.3
$1N12905: length 60.1
  Bottom Layer w0.254: 13.72,18.73 13.72,16.18 14.99,14.91 14.99,8.81 15.62,8.18 55.5,8.18 57.15,9.83 R7.2
$1N12949: length 5.3
  Top Layer w0.254: R5.1 74.26,3.72 1 Hz / 10 Hz.3
$1N12955: length 11.3
  Top Layer w0.254: 1 Hz / 10 Hz.1 67.82,3.68 67.82,2.46 68.58,1.7 75.75,1.7 R6.1
$1N13114: length 41
  Bottom Layer w0.254: R10.1 52.29,14.36 17.82,14.36 16.26,15.93 16.26,18.73
$1N13155: length 57.1
  Top Layer w0.254: v1(66.55,16.56) 66.55,12.24 67.44,11.35 C3.1 71.27,13.51 R11.1
  Bottom Layer w0.254: 26.42,18.73 64.38,18.73 v1(66.55,16.56)
$1N14608: length 55.3
  Top Layer w0.254: v1(64.52,34.85) 74HC10.6
  Bottom Layer w0.254: OUT#2.9 34.38,34.85 v1(64.52,34.85)
$1N14668: length 73.9
  Inner2 w0.254: B.14 30.23,67.32 28.19,69.35 28.19,88.7 A.14 34.42,86.54 40.64,86.54 41.15,86.03 41.15,76.63 41.78,76 58.37,76 74HC32.6
$1N14754: length 8.9
  Top Layer w0.254: 74HC10.11 59.44,67.31 74HC32.3
$1N14761: length 25.4
  Top Layer w0.254: 74HC10.12 59.44,59.36 74HC10.4
  Inner1 w0.254: 74HC10.12 56.9,64.44 55.5,65.84 55.5,74.09 57.02,75.62 57.02,77.34 74HC32.12
$1N14785: length 66.4
  Inner2 w0.254: 74HC10.8 67.06,61.77 60.71,55.42 60.71,52.88 44.83,37.01 v1(25.53,37.01)
  Bottom Layer w0.254: PC.9 18.76,34.47 22.99,34.47 v1(25.53,37.01)
$1N14858: length 53.1
  Bottom Layer w0.254: 74HC32.8 65.48,79.05 16.13,79.05 RegA.9
$1N14897: length 62.8
  Bottom Layer w0.254: 74HC32.11 58.12,76 43.81,76 42.29,74.47 42.29,59.36 41.15,58.22 21.84,58.22 17.99,54.36 RegB.9
$1N16389: length 25.5
  Top Layer w0.559: ON  /  OFF.2 5.08,21.51 7.87,18.72 7.87,12.04 7.33,11.49 5.46,11.49
  Top Layer w0.762: U7.2 1.65,22.4 2.54,21.51 ON  /  OFF.2
$1N30627: length 2.6
  Top Layer w0.381: 41.51,20.37 44.16,20.37
$1N33937: length 12.8
  Top Layer w0.254: R20.8 59.58,92.78 60.32,93.52 LED6.2
$1N33943: length 9.6
  Top Layer w0.254: R20.7 60.43,90.58 60.83,90.98 LED6.3
$1N33953: length 6.7
  Top Layer w0.254: LED6.4 61.99,88.38 61.23,88.38 60.98,88.13 60.98,83.85 61.23,83.6 R20.6
$1N33959: length 3.1
  Top Layer w0.254: LED6.5 62.08,85.87 R20.5
$1N34000: length 17.1
  Top Layer w0.254: 1K*4.8 64.86,82.77 63.77,83.86 63.77,95.06 64.77,96.06 LED6.10
$1N34011: length 13.4
  Top Layer w0.254: 1K*4.7 66.28,83.39 64.55,85.12 64.55,92.42 65.66,93.52 LED6.9
$1N34029: length 10.4
  Top Layer w0.254: 67.08,82.77 67.08,83.4 65.2,85.28 65.2,90.02 66.17,90.98 LED6.8
$1N34063: length 7.8
  Top Layer w0.254: LED6.7 67.06,88.37 65.97,88.37 65.79,88.19 65.79,85.51 67.93,83.36 1K*4.5
$1N35657: length 13.2
  Top Layer w0.254: R22.8 71.97,82.77 71.75,82.98 71.75,90.09 LED7.2
$1N35663: length 10
  Top Layer w0.254: LED7.3 74.29,90.98 72.9,89.59 72.9,84.36 73.77,83.49 R22.7
$1N35669: length 7.2
  Top Layer w0.254: R22.6 74.57,83.85 73.79,84.63 73.79,88.06 74.17,88.44 LED7.4
$1N35676: length 3.2
  Top Layer w0.254: R22.5 75.42,85.67 LED7.5
$1N35683: length 16.5
  Top Layer w0.254: 1K*4#2.8 78.56,83.32 76.61,85.27 76.61,93.94 78.74,96.06 LED7.10
$1N35689: length 13.9
  Top Layer w0.254: 1K*4#2.7 79.41,83.35 76.97,85.8 76.97,91.5 78.99,93.52 LED7.9
$1N35696: length 11.2
  Top Layer w0.254: 1K*4#2.6 80.17,82.8 80.17,83.3 77.32,86.15 77.32,88.93 79.25,90.86 80.14,90.86 LED7.8
$1N35703: length 9
  Top Layer w0.254: LED7.7 78.36,88.44 77.98,88.06 77.98,86.33 81.06,83.25 1K*4#2.5

## Copper pours and planes (outline as drawn; the poured copper is in the pictures)
GND on Top Layer: -4.44,103.68 104.01,103.68 104.01,-3.76 -4.44,-3.76
GND on Bottom Layer: -9.65,110.41 109.22,110.41 109.22,-9.98 -9.65,-9.98

Small or netless copper shapes (teardrops, artwork), in the pictures only: 242 on Top Layer, 93 on Bottom Layer, 50 on Inner1, 44 on Inner2

## Text on the board
Bottom Silkscreen Layer: JLCJLCJLCJLC | TD4-CPU / CORE / WISE1O0K / V0.2
Top Silkscreen Layer: +5V | GND | 74HC74 | 74HC161 | 74HC153 | 74HC283 | 1K | OUT | IN | 2 | 0 | 3 | 1 | TD4-CPU介绍 / REGA,REGB,PC,OUT / 分别为四个4位寄存器 / A,B为数据选择器 / ADD为算术逻辑单元 | TD4-CPU / CORE / WISE1O0K / V0.2 | ROM | IO | 跑马灯测试例程 / 0xB1 0xB2 0xB4 0xB8 / 0xF0 0x00 0x00 0x00 / 0x00 0x00 0x00 0x00
